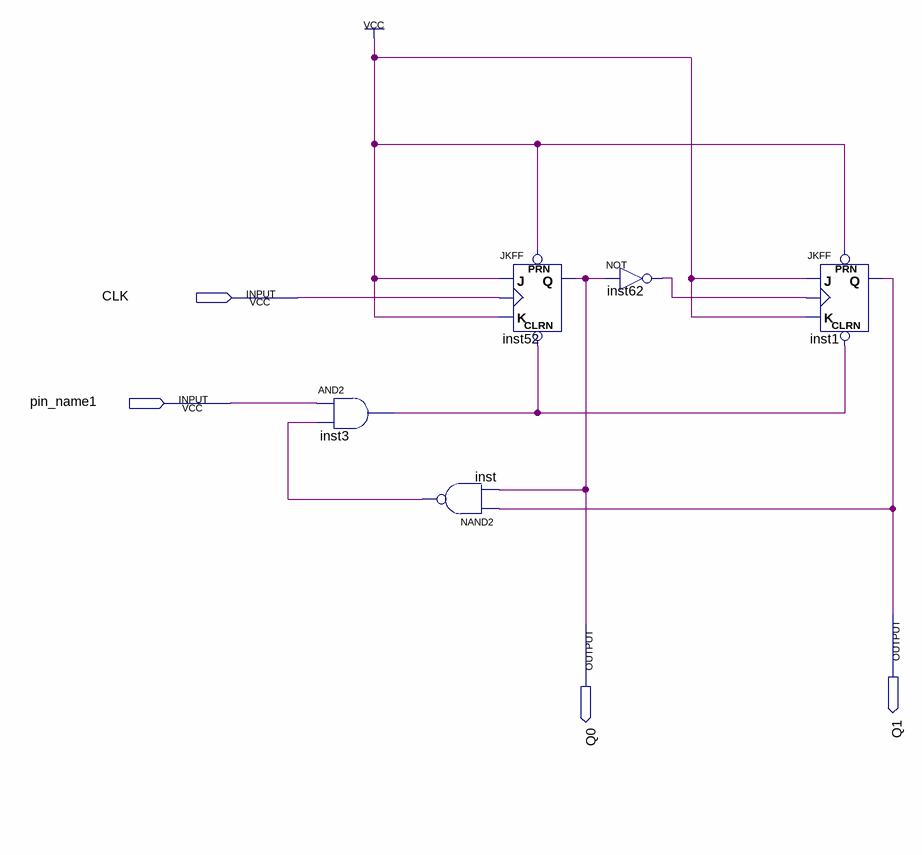
[diagram p0: schematic sheet]
// Quartus schematic HorasTruncadoTres.bdf as structural Verilog: 5 symbols, 4 pins
module HorasTruncadoTres (
  input  CLK,
  input  pin_name1,
  output Q1,
  output Q0
);

  wire inst3_out, inst62_out, inst_out;

  and inst3 (inst3_out, pin_name1, inst_out);
  nand inst (inst_out, Q1, Q0);
  JKFF inst52 (.PRN(1'b1), .CLRN(inst3_out), .K(1'b1), .J(1'b1), .CLK(CLK), .Q(Q0));
  not inst62 (inst62_out, Q0);
  JKFF inst1 (.PRN(1'b1), .CLRN(inst3_out), .K(1'b1), .J(1'b1), .CLK(inst62_out), .Q(Q1));
endmodule
